# Altium schematic sheet KBU1008-A2-00001_KBU1008-A2-0000.schdoc
size 124 x 99 mm
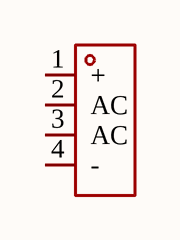
[diagram p0: KBU1008-A2-00001_KBU1008-A2-0000.schdoc]

## Parts
D?  KBU1008  [KBU_4P-L23.2-W6.8-P5.10]  (value not drawn)

## Nets

Not connected (* = marked no-connect by the designer): D? 1(+) 2(AC) 3(AC) 4(-)

## Library data of the parts
D? = KBU1008: Manufacturer: YANGJIE(扬杰); Symbol: KBU1008-A2-0000; Add into BOM: yes; Forward Voltage (Vf@If): 1.1V@5A; Reverse Voltage (Vr): 800V; Average Rectified Current (Io): 10A; Reverse Leakage Current (Ir): 10uA@800V; Peak Forward Surge Current: 170A; Device: KBU1008; LCSC Part Name: 电压:800V 电流:10A; Supplier Part: C781391; Manufacturer Part: KBU1008; Supplier Footprint: KBU; JLCPCB Part Class: Extended Part; Datasheet: https://atta.szlcsc.com/upload/public/pdf/source/20200429/C525723_C60B0D61B4DEC997859D4E414530B852.pdf; Supplier: LCSC; Convert to PCB: yes; Operating Temperature: -55℃~+150℃@(Tj)